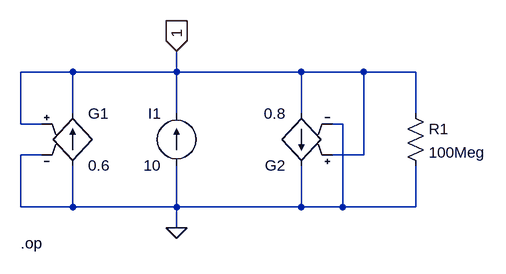
[diagram p0: schematic test_9.asc]
test_9.asc, the LTspice schematic file:
Version 4
SHEET 1 1284 680
WIRE 64 -80 -16 -80
WIRE 224 -80 224 -112
WIRE 224 -80 64 -80
WIRE 416 -80 224 -80
WIRE 512 -80 416 -80
WIRE 592 -80 512 -80
WIRE 64 -16 64 -80
WIRE 224 -16 224 -80
WIRE 416 -16 416 -80
WIRE 592 -16 592 -80
WIRE -16 0 -16 -80
WIRE 16 0 -16 0
WIRE 480 0 464 0
WIRE 16 48 -16 48
WIRE 512 48 512 -80
WIRE 512 48 464 48
WIRE -16 128 -16 48
WIRE 64 128 64 64
WIRE 64 128 -16 128
WIRE 224 128 224 64
WIRE 224 128 64 128
WIRE 416 128 416 64
WIRE 416 128 224 128
WIRE 480 128 480 0
WIRE 480 128 416 128
WIRE 592 128 592 64
WIRE 592 128 480 128
WIRE 224 160 224 128
FLAG 224 160 0
FLAG 224 -112 1
IOPIN 224 -112 In
SYMBOL g 64 -32 R0
SYMATTR InstName G1
SYMATTR Value 0.6
SYMBOL current 224 64 R180
WINDOW 0 24 80 Left 2
WINDOW 3 24 0 Left 2
WINDOW 123 0 0 Left 0
WINDOW 39 0 0 Left 0
SYMATTR InstName I1
SYMATTR Value 10
SYMBOL g 416 80 R180
SYMATTR InstName G2
SYMATTR Value 0.8
SYMBOL res 576 -32 R0
SYMATTR InstName R1
SYMATTR Value 100Meg
TEXT -16 184 Left 2 !.op

The netlist it stands for:
* test_9.asc
G1 0 1 1 0 0.6
I1 0 1 10
G2 1 0 1 0 0.8
R1 1 0 100Meg
.op
.backanno
.end